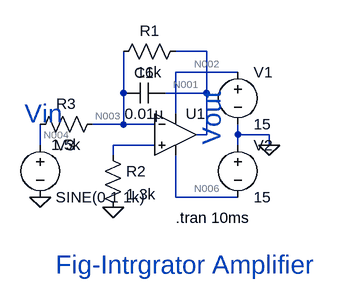
[diagram p0: schematic P-1.asc]
P-1.asc, the LTspice schematic file:
Version 4
SHEET 1 880 680
WIRE 288 80 240 80
WIRE 336 112 240 112
WIRE 160 144 160 80
WIRE 288 144 288 80
WIRE 288 144 224 144
WIRE 240 176 240 112
WIRE 160 192 160 144
WIRE 160 192 112 192
WIRE 208 192 160 192
WIRE 288 208 288 144
WIRE 288 208 272 208
WIRE 336 208 336 192
WIRE 384 208 336 208
WIRE 32 224 32 192
WIRE 208 224 144 224
WIRE 336 224 336 208
WIRE 384 224 384 208
WIRE 144 240 144 224
WIRE 240 304 240 240
WIRE 336 304 240 304
FLAG 384 224 0
FLAG 144 320 0
FLAG 32 304 0
SYMBOL voltage 336 96 R0
SYMATTR InstName V1
SYMATTR Value 15
SYMBOL voltage 336 208 R0
SYMATTR InstName V2
SYMATTR Value 15
SYMBOL voltage 32 208 R0
WINDOW 123 0 0 Left 0
WINDOW 39 0 0 Left 0
SYMATTR InstName V3
SYMATTR Value SINE(0 1 1k)
SYMBOL res 256 64 R90
WINDOW 0 0 56 VBottom 2
WINDOW 3 32 56 VTop 2
SYMATTR InstName R1
SYMATTR Value 16k
SYMBOL res 128 224 R0
SYMATTR InstName R2
SYMATTR Value 1.3k
SYMBOL res 128 176 R90
WINDOW 0 0 56 VBottom 2
WINDOW 3 32 56 VTop 2
SYMATTR InstName R3
SYMATTR Value 1.5k
SYMBOL cap 224 128 R90
WINDOW 0 0 32 VBottom 2
WINDOW 3 32 32 VTop 2
SYMATTR InstName C1
SYMATTR Value 0.01µ
SYMBOL OpAmps\\UniversalOpAmp 240 208 R0
SYMATTR InstName U1
TEXT 56 408 Left 4 ;Fig-Intrgrator Amplifier
TEXT 296 224 VLeft 4 ;Vout
TEXT 8 176 Left 4 ;Vin
TEXT 240 336 Left 2 !.tran 10ms

The netlist it stands for:
* P-1.asc
V1 N002 0 15
V2 0 N006 15
V3 N004 0 SINE(0 1 1k)
R1 N001 N003 16k
R2 N005 0 1.3k
R3 N003 N004 1.5k
C1 N001 N003 0.01µ
XU1 N005 N003 N002 N006 N001 level1 Avol=1Meg GBW=10Meg Vos=0 En=0 Enk=0 In=0 Ink=0 Rin=500Meg  ; pins In+ In- V+ V- OUT
* Fig-Intrgrator Amplifier
* Vout
* Vin
.tran 10ms
.lib UniversalOpAmp1.lib
.backanno
.end

* Results of the author's LTspice run, read from the files saved beside the schematic
* Operating Point, zero values left out:
*   V(n002) = 15 V
*   V(n006) = -15 V
*   I(V1) = -30 nA
*   I(V2) = -30 nA
*   Ix(u1:3) = 30 nA
*   Ix(u1:4) = -30 nA
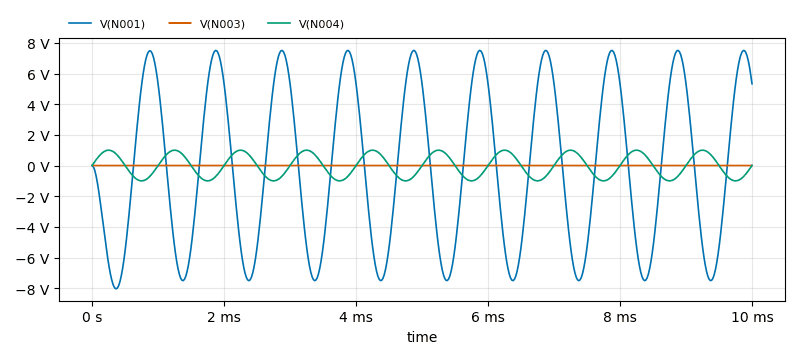
[diagram p1: Transient Analysis of P-1.asc, plotted from the saved traces]
* Transient Analysis, 1 run:
*   V(N001): min -8.04 V, max 7.51 V, average -85.56 mV, rms 5.332 V, last 5.334 V
*   V(N003): min -761.7 µV, max 751.3 µV, average -8.392 µV, rms 524.9 µV, last 524.6 µV
*   V(N004): min -1 V, max 1 V, average 22.63 µV, rms 707.1 mV, last 0 V